# EAGLE design cardedge_breakout (EAGLE 8.4.0)
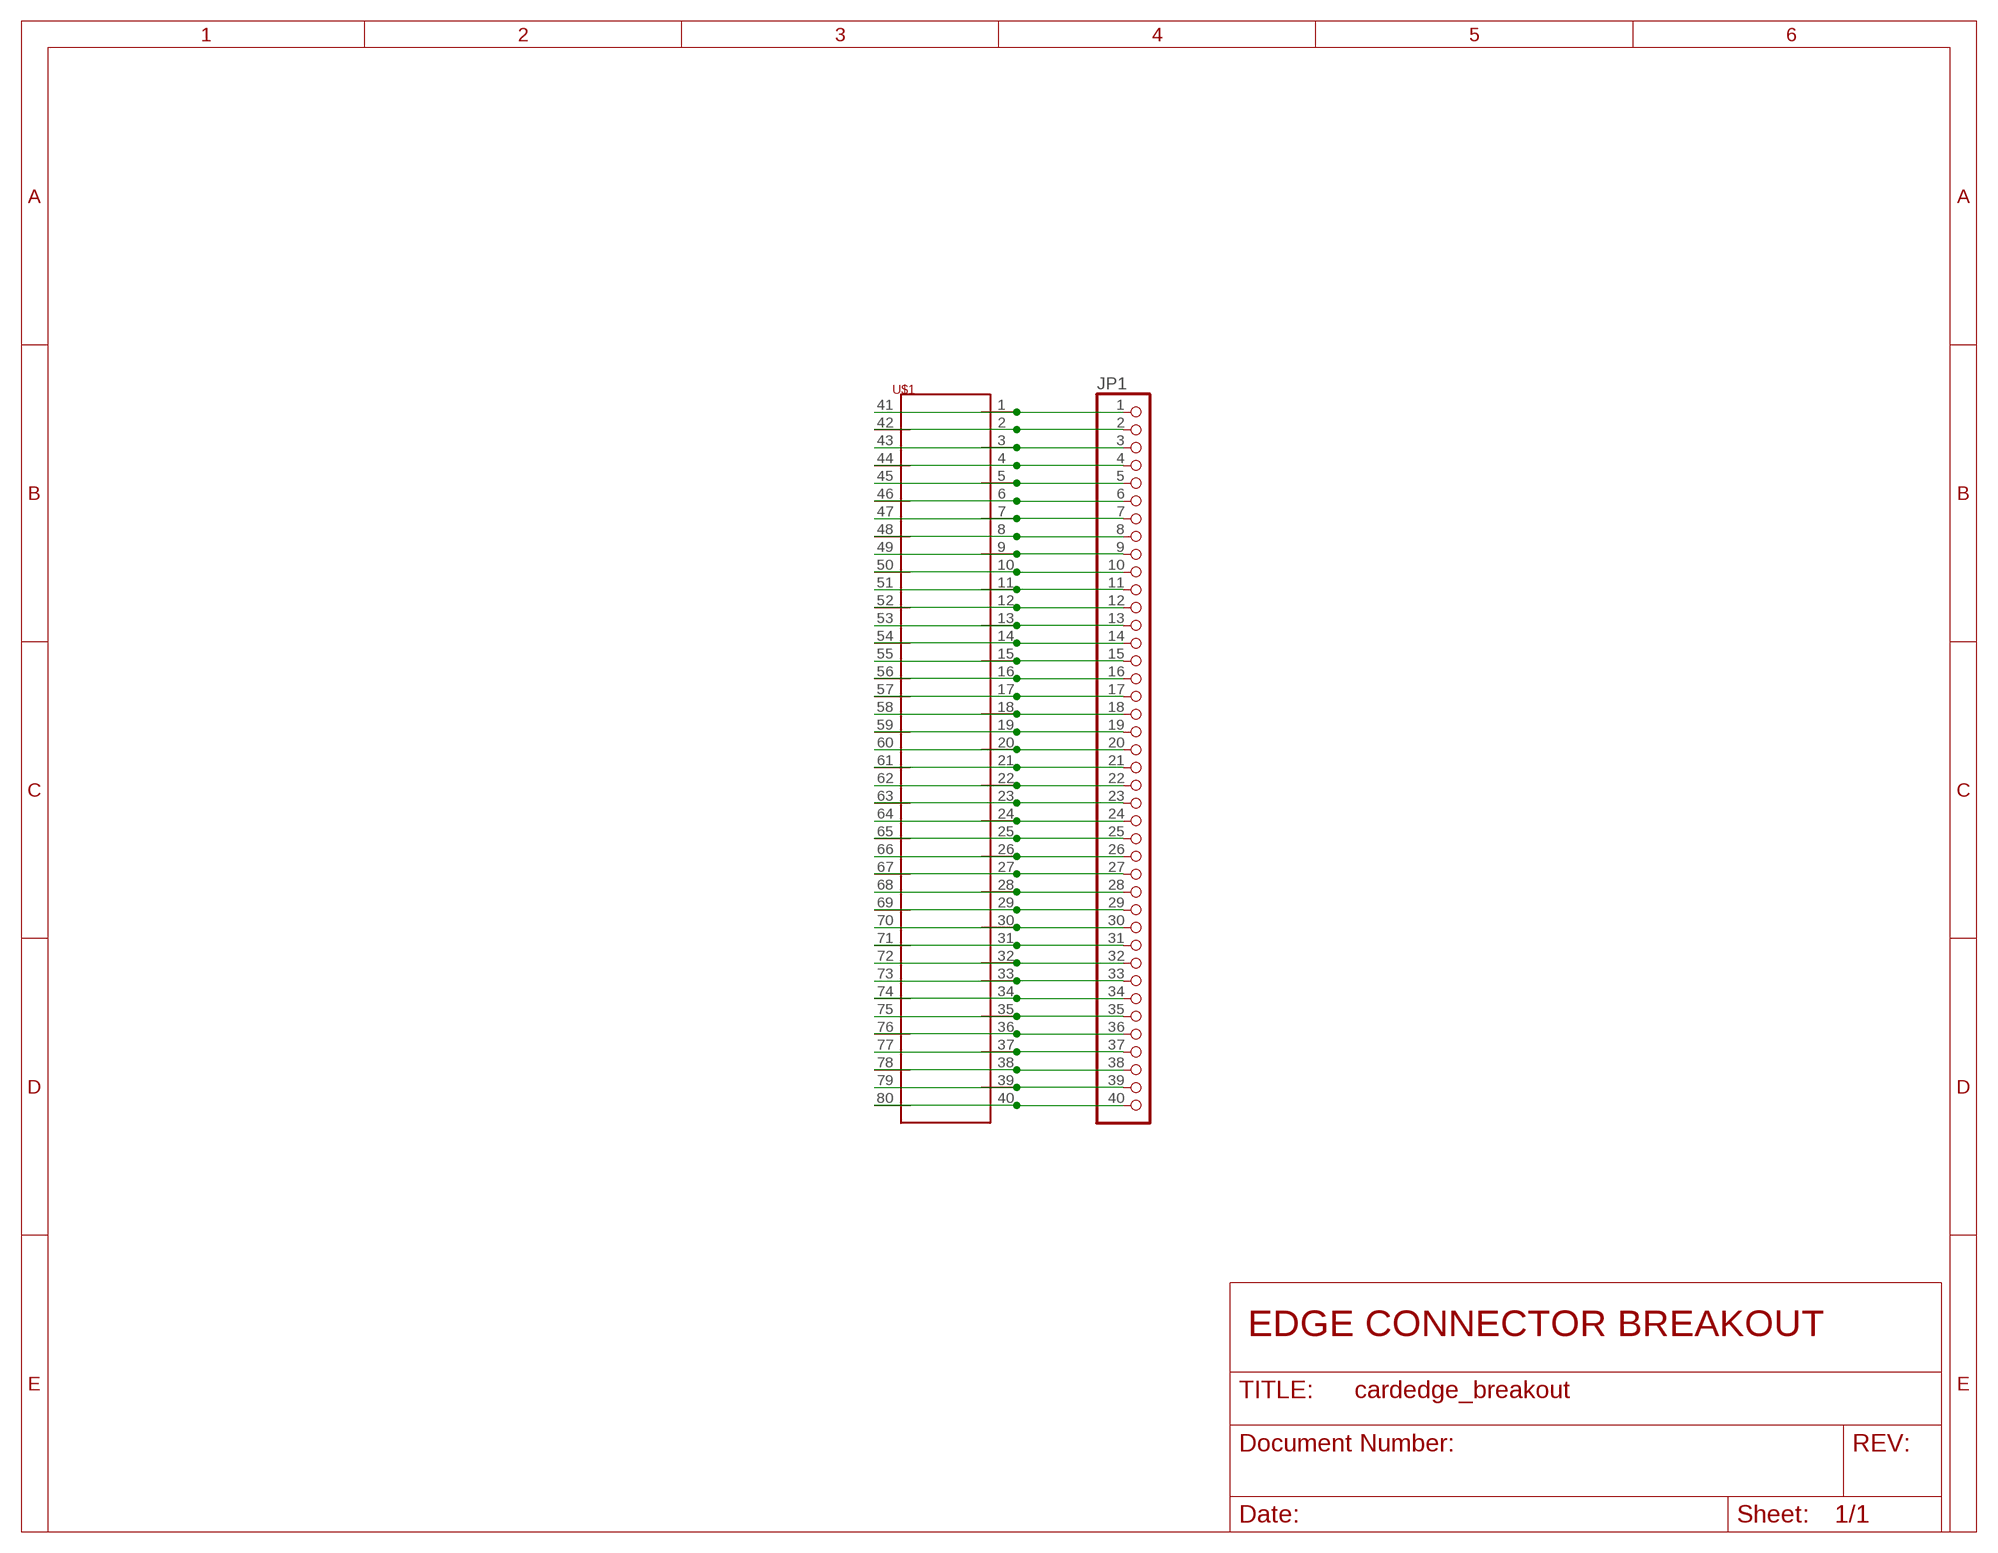
[diagram p0: schematic, sheet 1]

## Parts
JP1  PINHD-1X40  [1X40]
U$1  80-PIN-CARD-EDGE  [80-PIN-CARD-EDGE]
U$2  ILLINOISAUV  [ILLINOISAUV]  (not placed on a sheet)

## Nets
N$1: JP1.1 U$1.1 U$1.41
N$2: JP1.2 U$1.2 U$1.42
N$3: JP1.3 U$1.3 U$1.43
N$4: JP1.4 U$1.4 U$1.44
N$5: JP1.5 U$1.5 U$1.45
N$6: JP1.6 U$1.6 U$1.46
N$7: JP1.7 U$1.7 U$1.47
N$8: JP1.8 U$1.8 U$1.48
N$9: JP1.9 U$1.9 U$1.49
N$10: JP1.10 U$1.10 U$1.50
N$11: JP1.11 U$1.11 U$1.51
N$12: JP1.12 U$1.12 U$1.52
N$13: JP1.13 U$1.13 U$1.53
N$14: JP1.14 U$1.14 U$1.54
N$15: JP1.15 U$1.15 U$1.55
N$16: JP1.16 U$1.16 U$1.56
N$17: JP1.17 U$1.17 U$1.57
N$18: JP1.18 U$1.18 U$1.58
N$19: JP1.19 U$1.19 U$1.59
N$20: JP1.20 U$1.20 U$1.60
N$21: JP1.21 U$1.21 U$1.61
N$22: JP1.22 U$1.22 U$1.62
N$23: JP1.23 U$1.23 U$1.63
N$24: JP1.24 U$1.24 U$1.64
N$25: JP1.25 U$1.25 U$1.65
N$26: JP1.26 U$1.26 U$1.66
N$27: JP1.27 U$1.27 U$1.67
N$28: JP1.28 U$1.28 U$1.68
N$29: JP1.29 U$1.29 U$1.69
N$30: JP1.30 U$1.30 U$1.70
N$31: JP1.31 U$1.31 U$1.71
N$32: JP1.32 U$1.32 U$1.72
N$33: JP1.33 U$1.33 U$1.73
N$34: JP1.34 U$1.34 U$1.74
N$35: JP1.35 U$1.35 U$1.75
N$36: JP1.36 U$1.36 U$1.76
N$37: JP1.37 U$1.37 U$1.77
N$38: JP1.38 U$1.38 U$1.78
N$39: JP1.39 U$1.39 U$1.79
N$40: JP1.40 U$1.40 U$1.80

## Notes on the sheet
- EDGE CONNECTOR BREAKOUT

## Library data of the parts
JP1 = auv:PINHD-1X40: PIN HEADER
U$1 = auv:80-PIN-CARD-EDGE
U$2 = auv:ILLINOISAUV

## Board
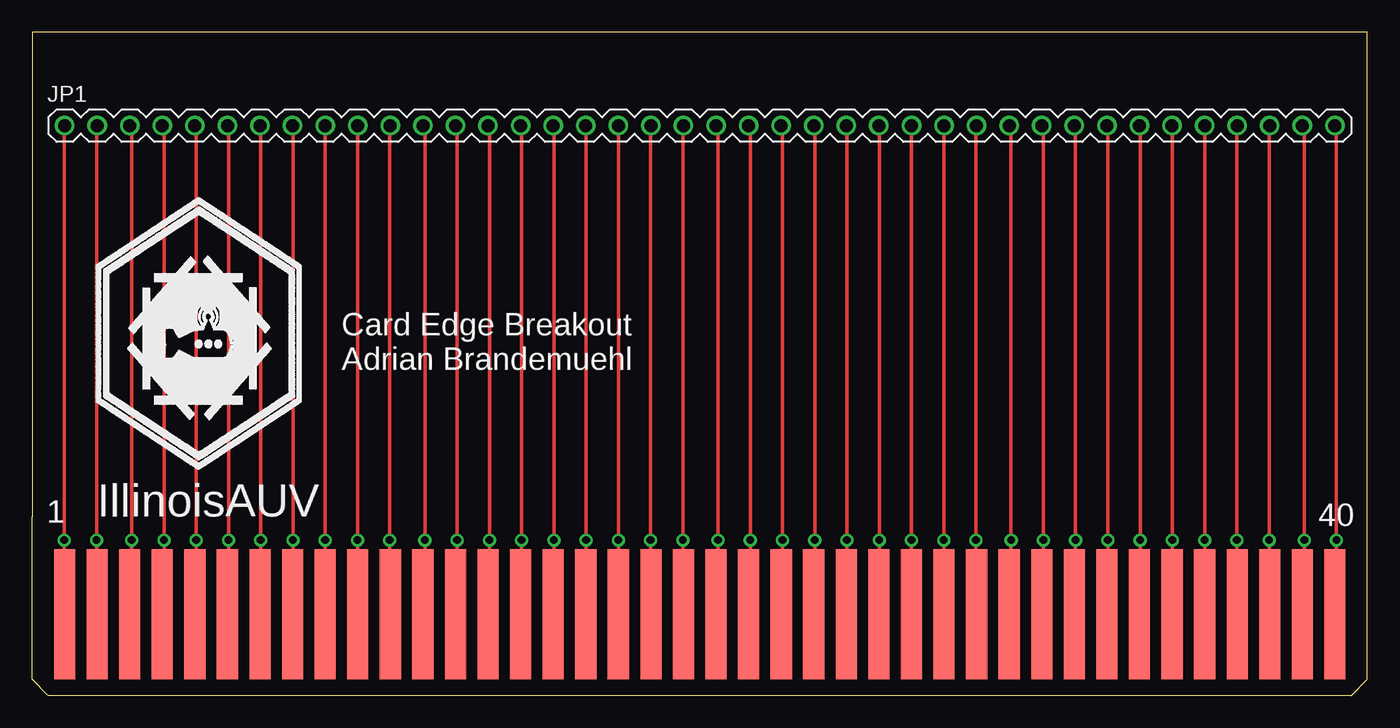
[diagram p1: board, top side]
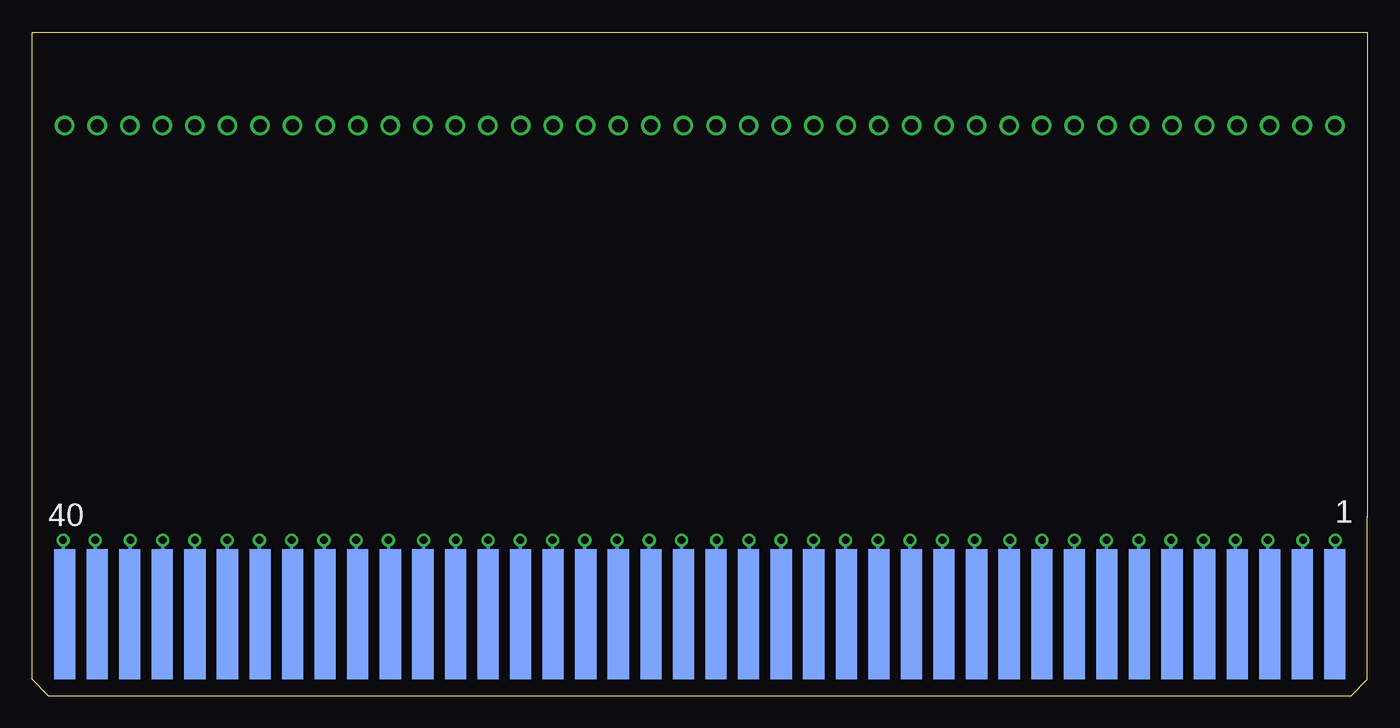
[diagram p2: board, bottom side, seen from below]

Size 104.14 x 51.74 mm. Coordinates in mm from the lower left corner, seen from the top.
Outline: 104.14,13.97 104.14,51.74 0,51.74 0,13.97
Copper layers (1*16): Top 0.035mm / dielectric 1.5mm / Bottom 0.035mm
Design rules "default": minimum track width 10mil, minimum drill 24mil, track to track 8mil, track to pad 8mil, pad to pad 8mil, via to via 8mil, smd to smd 8mil, copper to edge 40mil, drill to drill 8mil, minimum pad ring 10mil, minimum via ring 8mil, stop-mask expansion 4mil, vias tented up to drill 0mil, thermal gap 10mil

### Footprints (pad centres in the part's own frame; a part is rotated, then mirrored left to right if it is on the bottom)
1X40 = drill 1.016: 1 -49.53,0; 2 -46.99,0; 3 -44.45,0; 4 -41.91,0; 5 -39.37,0; 6 -36.83,0; 7 -34.29,0; 8 -31.75,0; 9 -29.21,0; 10 -26.67,0; 11 -24.13,0; 12 -21.59,0; 13 -19.05,0; 14 -16.51,0; 15 -13.97,0; 16 -11.43,0; 17 -8.89,0; 18 -6.35,0; 19 -3.81,0; 20 -1.27,0; 21 1.27,0; 22 3.81,0; 23 6.35,0; 24 8.89,0; 25 11.43,0; 26 13.97,0; 27 16.51,0; 28 19.05,0; 29 21.59,0; 30 24.13,0; 31 26.67,0; 32 29.21,0; 33 31.75,0; 34 34.29,0; 35 36.83,0; 36 39.37,0; 37 41.91,0; 38 44.45,0; 39 46.99,0; 40 49.53,0
80-PIN-CARD-EDGE = smd 1.651 x 10.16: 1 -49.53,0; 2 -46.99,0; 3 -44.45,0; 4 -41.91,0; 5 -39.37,0; 6 -36.83,0; 7 -34.29,0; 8 -31.75,0; 9 -29.21,0; 10 -26.67,0; 11 -24.13,0; 12 -21.59,0; 13 -19.05,0; 14 -16.51,0; 15 -13.97,0; 16 -11.43,0; 17 -8.89,0; 18 -6.35,0; 19 -3.81,0; 20 -1.27,0; 21 1.27,0; 22 3.81,0; 23 6.35,0; 24 8.89,0; 25 11.43,0; 26 13.97,0; 27 16.51,0; 28 19.05,0; 29 21.59,0; 30 24.13,0; 31 26.67,0; 32 29.21,0; 33 31.75,0; 34 34.29,0; 35 36.83,0; 36 39.37,0; 37 41.91,0; 38 44.45,0; 39 46.99,0; 40 49.53,0 | smd 1.651 x 10.16 bottom: 41 -49.53,0; 42 -46.99,0; 43 -44.45,0; 44 -41.91,0; 45 -39.37,0; 46 -36.83,0; 47 -34.29,0; 48 -31.75,0; 49 -29.21,0; 50 -26.67,0; 51 -24.13,0; 52 -21.59,0; 53 -19.05,0; 54 -16.51,0; 55 -13.97,0; 56 -11.43,0; 57 -8.89,0; 58 -6.35,0; 59 -3.81,0; 60 -1.27,0; 61 1.27,0; 62 3.81,0; 63 6.35,0; 64 8.89,0; 65 11.43,0; 66 13.97,0; 67 16.51,0; 68 19.05,0; 69 21.59,0; 70 24.13,0; 71 26.67,0; 72 29.21,0; 73 31.75,0; 74 34.29,0; 75 36.83,0; 76 39.37,0; 77 41.91,0; 78 44.45,0; 79 46.99,0; 80 49.53,0

### Placement (x,y rotation side)
JP1  52.07,44.45 0 top
U$1  52.07,6.35 0 top
U$2  13.97,26.67 0 top

### Tracks (layer width: path | path; a pad name or v marks a point on that pad's centre or on a via)
N$1  (via drill 0.61)
  Top 0.254: JP1.1 2.52,44.37 v2.52,12.14 2.52,6.43 U$1.41
  Bottom 0.254: v2.52,12.14 2.52,6.43 U$1.41
N$2  (via drill 0.61)
  Top 0.254: JP1.2 5.03,44.37 v5.03,12.14 5.03,6.43 U$1.42
  Bottom 0.254: v5.03,12.14 5.03,6.43 U$1.42
N$3  (via drill 0.61)
  Top 0.254: JP1.3 7.77,44.37 v7.77,12.14 7.77,6.43 U$1.43
  Bottom 0.254: v7.77,12.14 7.77,6.43 U$1.43
N$4  (via drill 0.61)
  Top 0.254: JP1.4 10.29,44.37 v10.29,12.14 10.29,6.43 U$1.44
  Bottom 0.254: v10.29,12.14 10.29,6.43 U$1.44
N$5  (via drill 0.61)
  Top 0.254: JP1.5 12.8,44.37 v12.8,12.14 12.8,6.43 U$1.45
  Bottom 0.254: v12.8,12.14 12.8,6.43 U$1.45
N$6  (via drill 0.61)
  Top 0.254: JP1.6 15.32,44.37 v15.32,12.14 15.32,6.43 U$1.46
  Bottom 0.254: v15.32,12.14 15.32,6.43 U$1.46
N$7  (via drill 0.61)
  Top 0.254: JP1.7 17.83,44.37 v17.83,12.14 17.83,6.43 U$1.47
  Bottom 0.254: v17.83,12.14 17.83,6.43 U$1.47
N$8  (via drill 0.61)
  Top 0.254: JP1.8 20.34,44.37 v20.34,12.14 20.34,6.43 U$1.48
  Bottom 0.254: v20.34,12.14 20.34,6.43 U$1.48
N$9  (via drill 0.61)
  Top 0.254: U$1.49 v22.86,12.14 JP1.9
  Bottom 0.254: v22.86,12.14 U$1.49
N$10  (via drill 0.61)
  Top 0.254: JP1.10 25.38,44.37 v25.38,12.14 25.38,6.43 U$1.50
  Bottom 0.254: v25.38,12.14 25.38,6.43 U$1.50
N$11  (via drill 0.61)
  Top 0.254: JP1.11 27.89,44.37 v27.89,12.14 27.89,6.43 U$1.51
  Bottom 0.254: v27.89,12.14 27.89,6.43 U$1.51
N$12  (via drill 0.61)
  Top 0.254: JP1.12 30.63,44.37 v30.63,12.14 30.63,6.43 U$1.52
  Bottom 0.254: v30.63,12.14 30.63,6.43 U$1.52
N$13  (via drill 0.61)
  Top 0.254: JP1.13 33.15,44.37 v33.15,12.14 33.15,6.43 U$1.53
  Bottom 0.254: v33.15,12.14 33.15,6.43 U$1.53
N$14  (via drill 0.61)
  Top 0.254: JP1.14 35.66,44.37 v35.66,12.14 35.66,6.43 U$1.54
  Bottom 0.254: v35.66,12.14 35.66,6.43 U$1.54
N$15  (via drill 0.61)
  Top 0.254: JP1.15 38.18,44.37 v38.18,12.14 38.18,6.43 U$1.55
  Bottom 0.254: v38.18,12.14 38.18,6.43 U$1.55
N$16  (via drill 0.61)
  Top 0.254: JP1.16 40.69,44.37 v40.69,12.14 40.69,6.43 U$1.56
  Bottom 0.254: v40.69,12.14 40.69,6.43 U$1.56
N$17  (via drill 0.61)
  Top 0.254: JP1.17 43.2,44.37 v43.2,12.14 43.2,6.43 U$1.57
  Bottom 0.254: v43.2,12.14 43.2,6.43 U$1.57
N$18  (via drill 0.61)
  Top 0.254: U$1.58 v45.72,12.14 JP1.18
  Bottom 0.254: v45.72,12.14 U$1.58
N$19  (via drill 0.61)
  Top 0.254: JP1.19 48.23,44.37 v48.23,12.14 48.23,6.43 U$1.59
  Bottom 0.254: v48.23,12.14 48.23,6.43 U$1.59
N$20  (via drill 0.61)
  Top 0.254: JP1.20 50.75,44.37 v50.75,12.14 50.75,6.43 U$1.60
  Bottom 0.254: v50.75,12.14 50.75,6.43 U$1.60
N$21  (via drill 0.61)
  Top 0.254: JP1.21 53.49,44.37 v53.49,12.14 53.49,6.43 U$1.61
  Bottom 0.254: v53.49,12.14 53.49,6.43 U$1.61
N$22  (via drill 0.61)
  Top 0.254: JP1.22 56.01,44.37 v56.01,12.14 56.01,6.43 U$1.62
  Bottom 0.254: v56.01,12.14 56.01,6.43 U$1.62
N$23  (via drill 0.61)
  Top 0.254: JP1.23 58.52,44.37 v58.52,12.14 58.52,6.43 U$1.63
  Bottom 0.254: v58.52,12.14 58.52,6.43 U$1.63
N$24  (via drill 0.61)
  Top 0.254: JP1.24 61.04,44.37 v61.04,12.14 61.04,6.43 U$1.64
  Bottom 0.254: v61.04,12.14 61.04,6.43 U$1.64
N$25  (via drill 0.61)
  Top 0.254: JP1.25 63.55,44.37 v63.55,12.14 63.55,6.43 U$1.65
  Bottom 0.254: v63.55,12.14 63.55,6.43 U$1.65
N$26  (via drill 0.61)
  Top 0.254: JP1.26 66.06,44.37 v66.06,12.14 66.06,6.43 U$1.66
  Bottom 0.254: v66.06,12.14 66.06,6.43 U$1.66
N$27  (via drill 0.61)
  Top 0.254: U$1.67 v68.58,12.14 JP1.27
  Bottom 0.254: v68.58,12.14 U$1.67
N$28  (via drill 0.61)
  Top 0.254: JP1.28 71.09,44.37 v71.09,12.14 71.09,6.43 U$1.68
  Bottom 0.254: v71.09,12.14 71.09,6.43 U$1.68
N$29  (via drill 0.61)
  Top 0.254: JP1.29 73.61,44.37 v73.61,12.14 73.61,6.43 U$1.69
  Bottom 0.254: v73.61,12.14 73.61,6.43 U$1.69
N$30  (via drill 0.61)
  Top 0.254: JP1.30 76.35,44.37 v76.35,12.14 76.35,6.43 U$1.70
  Bottom 0.254: v76.35,12.14 76.35,6.43 U$1.70
N$31  (via drill 0.61)
  Top 0.254: JP1.31 78.87,44.37 v78.87,12.14 78.87,6.43 U$1.71
  Bottom 0.254: v78.87,12.14 78.87,6.43 U$1.71
N$32  (via drill 0.61)
  Top 0.254: JP1.32 81.38,44.37 v81.38,12.14 81.38,6.43 U$1.72
  Bottom 0.254: v81.38,12.14 81.38,6.43 U$1.72
N$33  (via drill 0.61)
  Top 0.254: JP1.33 83.9,44.37 v83.9,12.14 83.9,6.43 U$1.73
  Bottom 0.254: v83.9,12.14 83.9,6.43 U$1.73
N$34  (via drill 0.61)
  Top 0.254: JP1.34 86.41,44.37 v86.41,12.14 86.41,6.43 U$1.74
  Bottom 0.254: v86.41,12.14 86.41,6.43 U$1.74
N$35  (via drill 0.61)
  Top 0.254: JP1.35 88.92,44.37 v88.92,12.14 88.92,6.43 U$1.75
  Bottom 0.254: v88.92,12.14 88.92,6.43 U$1.75
N$36  (via drill 0.61)
  Top 0.254: U$1.76 v91.44,12.14 JP1.36
  Bottom 0.254: v91.44,12.14 U$1.76
N$37  (via drill 0.61)
  Top 0.254: JP1.37 93.95,44.37 v93.95,12.14 93.95,6.43 U$1.77
  Bottom 0.254: v93.95,12.14 93.95,6.43 U$1.77
N$38  (via drill 0.61)
  Top 0.254: JP1.38 96.47,44.37 v96.47,12.14 96.47,6.43 U$1.78
  Bottom 0.254: v96.47,12.14 96.47,6.43 U$1.78
N$39  (via drill 0.61)
  Top 0.254: JP1.39 99.21,44.37 v99.21,12.14 99.21,6.43 U$1.79
  Bottom 0.254: v99.21,12.14 99.21,6.43 U$1.79
N$40  (via drill 0.61)
  Top 0.254: JP1.40 101.73,44.37 v101.73,12.14 101.73,6.43 U$1.80
  Bottom 0.254: v101.73,12.14 101.73,6.43 U$1.80

### Text on the board
tNames: Card Edge Breakout / Adrian Brandemuehl | 1 | 40
bNames: 1 | 40